# Altium schematic sheet Feedback.SchDoc
size A4
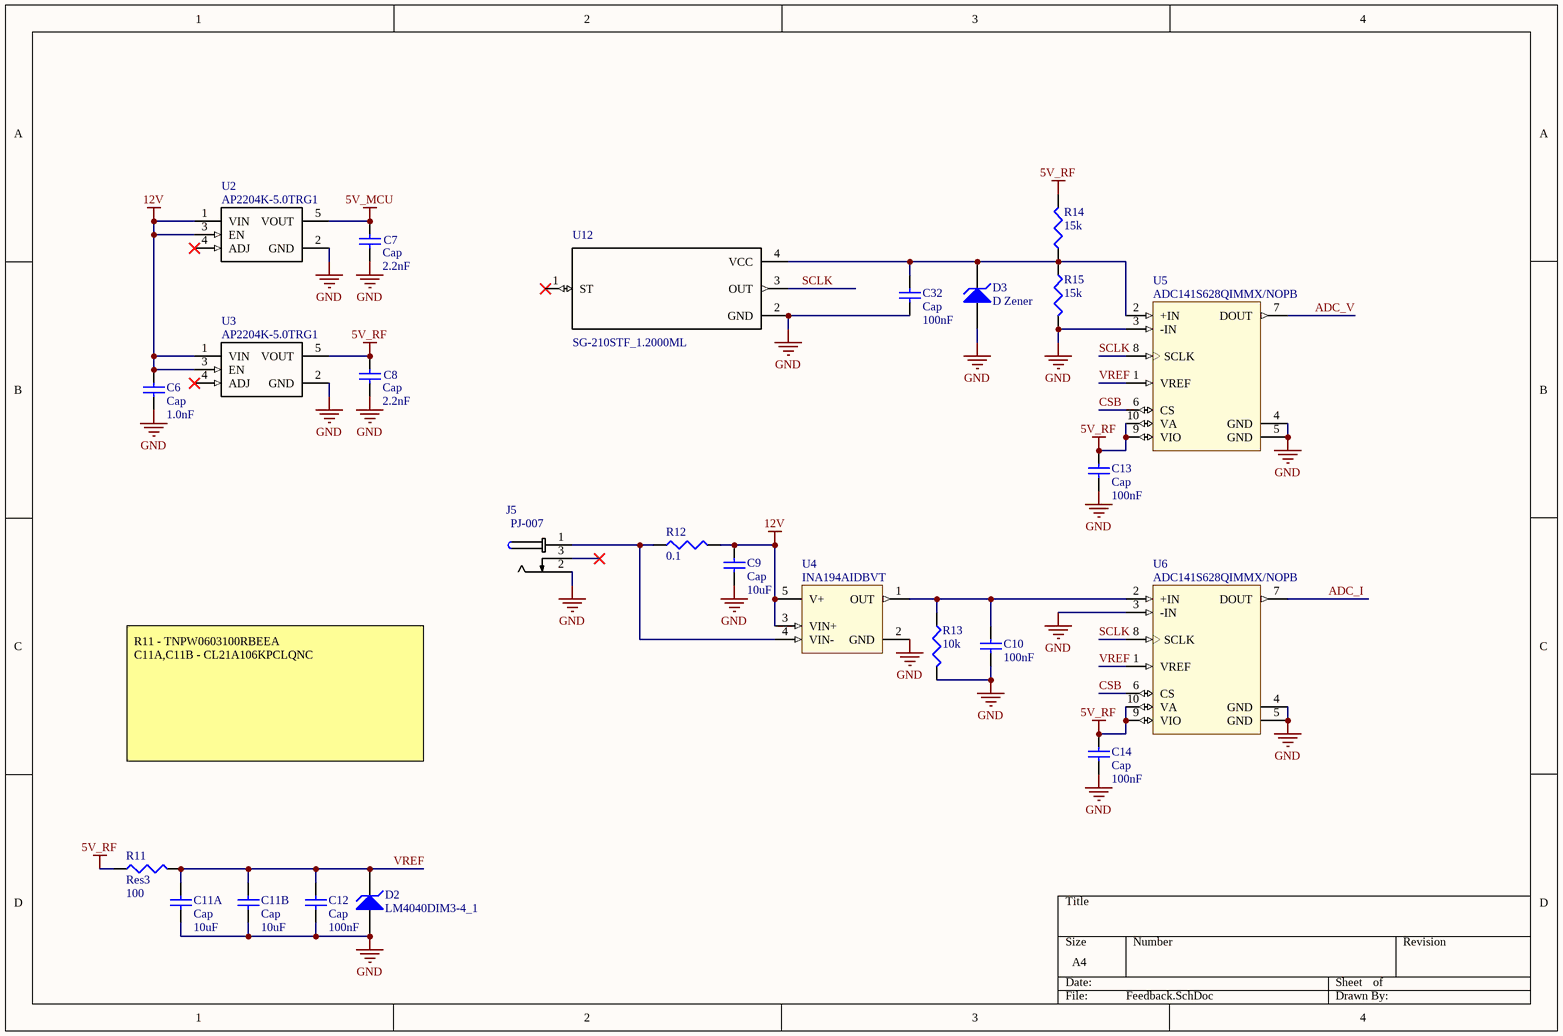
[diagram p0: Feedback.SchDoc]

## Parts
C6  Cap  value 1.0nF  [1608[0603]]
C7  Cap  value 2.2nF  [1608[0603]]
C8  Cap  value 2.2nF  [1608[0603]]
C9  Cap  value 10uF  [C0805]
C10  100nF  [1608[0603]]
C11A  Cap  value 10uF  [C0805]
C11B  Cap  value 10uF  [C0805]
C12  Cap  value 100nF  [1608[0603]]
C13  Cap  value 100nF  [1608[0603]]
C14  Cap  value 100nF  [1608[0603]]
C32  Cap  value 100nF  [1608[0603]]
D2  LM4040DIM3-4_1  [SOT95P237X112-3N]
D3  D Zener  [SODFL250X110-2N]
J5  PJ-007  [PJ-007]
R11  Res3  value 100  [J1-0603]
R12  0.1  [TO-252-3]
R13  10k  [J1-0603]
R14  15k  [J1-0603]
R15  15k  [J1-0603]
U2  AP2204K-5.0TRG1  [SOT95P280X145-5N]
U3  AP2204K-5.0TRG1  [SOT95P280X145-5N]
U4  INA194AIDBVT  [SOT95P280X145-5N]
U5  ADC141S628QIMMX/NOPB  [SOP50P490X110-11N]
U6  ADC141S628QIMMX/NOPB  [SOP50P490X110-11N]
U12  SG-210STF_1.2000ML  [OSCCC200X160X50]

## Nets
5V_MCU: C7.2 U2.5(VOUT)
5V_RF: C8.2 C13.1 C14.1 R11.2 R14.1 U3.5(VOUT) U5.9(VIO) U5.10(VA) U6.9(VIO) U6.10(VA)
12V: C6.1 C9.1 R12.1 U2.1(VIN) U2.3(EN) U3.1(VIN) U3.3(EN) U4.3(VIN+) U4.5(V+)
GND: C6.2 C7.1 C8.1 C9.2 C10.1 C11A.2 C11B.2 C12.2 C13.2 C14.2 C32.2 D2.1(A) D3.1(A) J5.2(S) R13.2 R15.1 U2.2(GND) U3.2(GND) U4.2(GND) U5.3(-IN) U5.4(GND) U5.5(GND) U6.3(-IN) U6.4(GND) U6.5(GND) U12.2(GND)
ADC_I: U6.7(DOUT)
ADC_V: U5.7(DOUT)
CSB: U5.6(CS) U6.6(CS)
SCLK: U5.8(SCLK) U6.8(SCLK) U12.3(OUT)
VREF: C11A.1 C11B.1 C12.1 D2.2(K) R11.1 U5.1(VREF) U6.1(VREF)
NetC10_2: C10.2 R13.1 U4.1(OUT) U6.2(+IN)
NetC32_1: C32.1 D3.2(K) R14.2 R15.2 U5.2(+IN) U12.4(VCC)
NetJ5_1: J5.1(T) R12.2 U4.4(VIN-)

Not connected (* = marked no-connect by the designer): J5 3(SS)*; U2 4(ADJ)*; U3 4(ADJ)*; U12 1(ST)*

## Notes on the sheet
- R11 - TNPW0603100RBEEA
  C11A,C11B - CL21A106KPCLQNC

## Library data of the parts
C6-C10 C11A C11B C12-C14 C32 = Cap Semi: Capacitor (Semiconductor SIM Model); Published: 8-Jun-2000; LatestRevisionDate: 29-May-2009; LatestRevisionNote: IPC-7351 Footprint Added.; PackageReference: C1206; Publisher: Altium Limited; PackageDescription: Chip Capacitor
  C10: Value: 100nF
D2 = LM4040DIM3-4_1: IC VREF SHUNT 4.096V SOT23; MF: Texas Instruments; MP: LM404DIM4-4.1; Availability: Good; Package: SOT23 Texas Instruments; Price: 0.41 USD; Value: *; Supplier 1: Digi-Key; Supplier Part Number 1: LM4040DIM3-4.1/NOPBCT-ND
D3 = D Zener: Zener Diode; Published: 8-Jun-2000; LatestRevisionDate: 17-Jul-2002; LatestRevisionNote: Re-released for DXP Platform.; PackageReference: DIODE-0.7; Publisher: Altium Limited; PackageDescription: Diode, Thru-Hole; 2 Leads; 0.7 in Pin Spacing
J5 = PJ-007: 1.3 mm Center Pin, 1.0 A, Right Angle, Through Hole, Dc Power Jack Connector; MF: CUI; SnapEDA_Link: https://www.snapeda.com/parts/PJ-007/CUI/view-part/?ref=snap; Availability: Good; Package: None; Price: 0.36 USD; MP: PJ-007; Value: *
R11-R15 = Res3: Resistor; Published: 8-Jun-2000; LatestRevisionDate: 29-May-2009; LatestRevisionNote: IPC-7351 Footprint Added.; PackageReference: J1-0603; Publisher: Altium Limited; PackageDescription: Chip Resistor
  R12: Value: 0.1
  R13: Value: 10k
  R14 R15: Value: 15k
U2 U3 = AP2204K-5.0TRG1: IC REG LINEAR 5V 150MA SOT23-5; MF: Diodes Inc.; Availability: Good; MP: AP2204K-5.0TRG1; Price: 0.20 USD; Package: SOT-23-5 Diodes Inc.; Value: *
U4 = INA194AIDBVT: IC CURRENT MONITOR 3% SOT23-5; MF: Texas Instruments; Package: SOT-23 Texas Instruments; MP: INA194AIDBVT; Price: 1.55 USD; Availability: Good; Value: *
U5 U6 = ADC141S628QIMMX/NOPB: IC CONVERTER A/D 14-BIT 10-MSOP; MF: Texas Instruments; Availability: Good; Price: 4.07 USD; MP: ADC141S628QIMMX/NOPB; Package: MSOP-10 Texas Instruments; Value: *
U12 = SG-210STF_1.2000ML: Spxo 1.6-3.6v 50ppm -40/+85c; MP: SG-210STF 1.2000ML; MF: EPSON; Availability: Bad; SnapEDA_Link: https://www.snapeda.com/symbols-footprints/SG-210STF%201.2000ML/EPSON/view-part/?ref=snap; Package: SMD-4 Epson; Price: 1.41 USD; Value: *